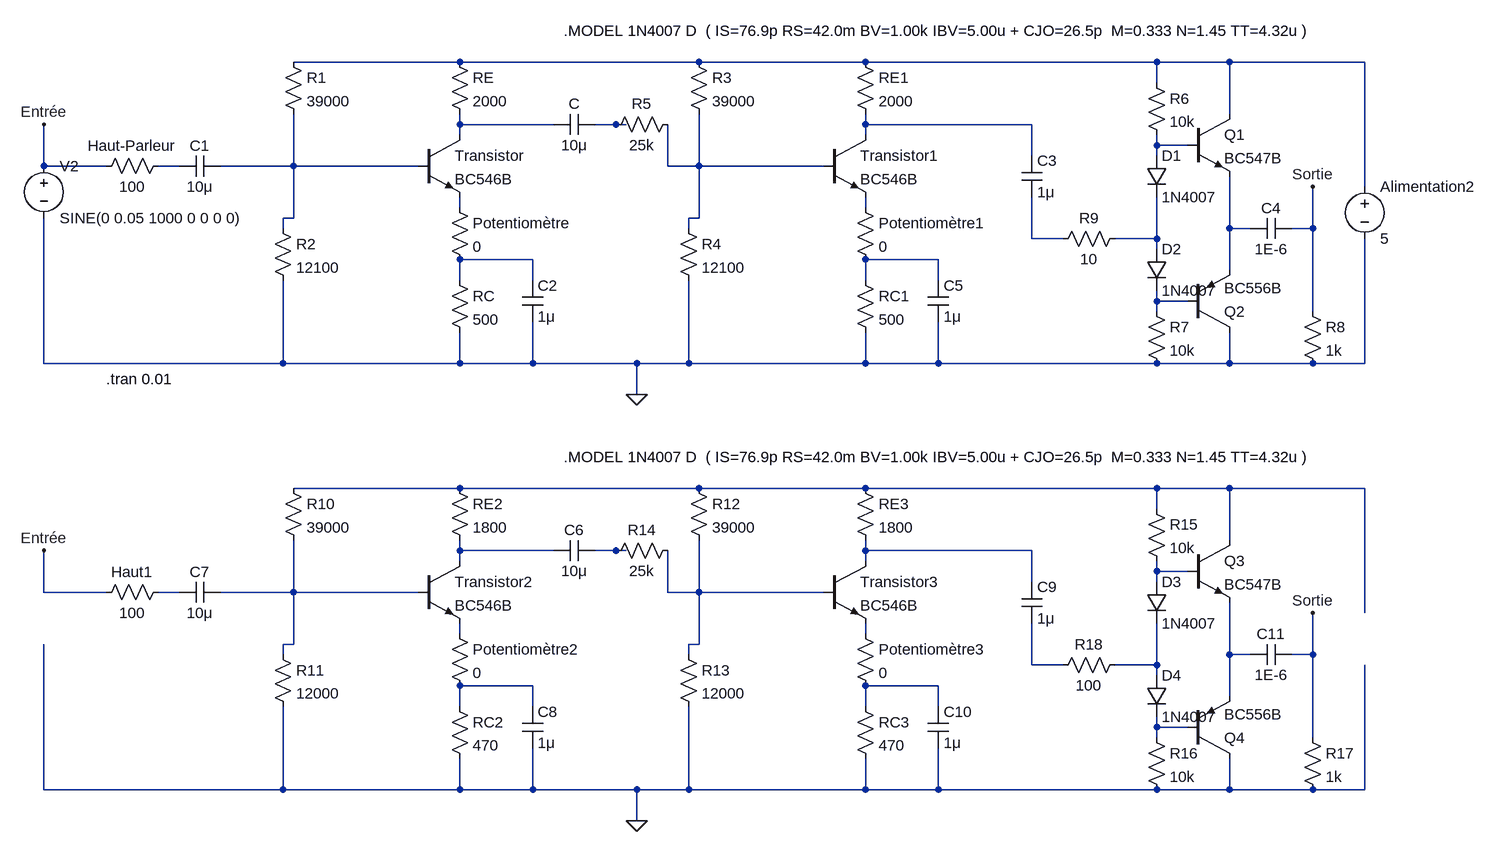
[diagram p0: schematic Cascade+PushPull - Copie.asc]
Cascade+PushPull - Copie.asc, the LTspice schematic file:
Version 4
SHEET 1 2696 1204
WIRE 368 16 112 16
WIRE 736 16 368 16
WIRE 992 16 736 16
WIRE 1440 16 992 16
WIRE 1552 16 1440 16
WIRE 1760 16 1552 16
WIRE 1440 48 1440 16
WIRE 1552 96 1552 16
WIRE 368 112 368 96
WIRE 512 112 368 112
WIRE 608 112 576 112
WIRE 624 112 608 112
WIRE 992 112 992 96
WIRE 1248 112 992 112
WIRE 368 128 368 112
WIRE 992 128 992 112
WIRE 1440 144 1440 128
WIRE 1488 144 1440 144
WIRE 1248 160 1248 112
WIRE 1440 160 1440 144
WIRE -272 176 -272 112
WIRE -176 176 -272 176
WIRE -64 176 -96 176
WIRE 112 176 112 96
WIRE 112 176 0 176
WIRE 304 176 112 176
WIRE 688 176 688 112
WIRE 736 176 736 96
WIRE 736 176 688 176
WIRE 928 176 736 176
WIRE 1760 208 1760 16
WIRE 368 240 368 224
WIRE 992 240 992 224
WIRE 112 256 112 176
WIRE 112 256 96 256
WIRE 736 256 736 176
WIRE 736 256 720 256
WIRE 96 272 96 256
WIRE 720 272 720 256
WIRE 1552 272 1552 192
WIRE 1584 272 1552 272
WIRE 1680 272 1680 208
WIRE 1680 272 1648 272
WIRE 1248 288 1248 224
WIRE 1296 288 1248 288
WIRE 1440 288 1440 224
WIRE 1440 288 1376 288
WIRE 1440 304 1440 288
WIRE 480 320 368 320
WIRE 1104 320 992 320
WIRE 1552 336 1552 272
WIRE 368 352 368 320
WIRE 480 352 480 320
WIRE 992 352 992 320
WIRE 1104 352 1104 320
WIRE 1440 384 1440 368
WIRE 1488 384 1440 384
WIRE 1440 400 1440 384
WIRE 1680 400 1680 272
WIRE -272 480 -272 256
WIRE 96 480 96 352
WIRE 96 480 -272 480
WIRE 368 480 368 432
WIRE 368 480 96 480
WIRE 480 480 480 416
WIRE 480 480 368 480
WIRE 640 480 480 480
WIRE 720 480 720 352
WIRE 720 480 640 480
WIRE 992 480 992 432
WIRE 992 480 720 480
WIRE 1104 480 1104 416
WIRE 1104 480 992 480
WIRE 1440 480 1104 480
WIRE 1552 480 1552 432
WIRE 1552 480 1440 480
WIRE 1680 480 1552 480
WIRE 1760 480 1760 288
WIRE 1760 480 1680 480
WIRE 640 528 640 480
WIRE 368 672 112 672
WIRE 736 672 368 672
WIRE 992 672 736 672
WIRE 1440 672 992 672
WIRE 1552 672 1440 672
WIRE 1760 672 1552 672
WIRE 1440 704 1440 672
WIRE 1552 752 1552 672
WIRE 368 768 368 752
WIRE 512 768 368 768
WIRE 608 768 576 768
WIRE 624 768 608 768
WIRE 992 768 992 752
WIRE 1248 768 992 768
WIRE 368 784 368 768
WIRE 992 784 992 768
WIRE 1440 800 1440 784
WIRE 1488 800 1440 800
WIRE 1248 816 1248 768
WIRE 1440 816 1440 800
WIRE -272 832 -272 768
WIRE -176 832 -272 832
WIRE -64 832 -96 832
WIRE 112 832 112 752
WIRE 112 832 0 832
WIRE 304 832 112 832
WIRE 688 832 688 768
WIRE 736 832 736 752
WIRE 736 832 688 832
WIRE 928 832 736 832
WIRE 1760 864 1760 672
WIRE 368 896 368 880
WIRE 992 896 992 880
WIRE 112 912 112 832
WIRE 112 912 96 912
WIRE 736 912 736 832
WIRE 736 912 720 912
WIRE 96 928 96 912
WIRE 720 928 720 912
WIRE 1552 928 1552 848
WIRE 1584 928 1552 928
WIRE 1680 928 1680 864
WIRE 1680 928 1648 928
WIRE 1248 944 1248 880
WIRE 1296 944 1248 944
WIRE 1440 944 1440 880
WIRE 1440 944 1376 944
WIRE 1440 960 1440 944
WIRE 480 976 368 976
WIRE 1104 976 992 976
WIRE 1552 992 1552 928
WIRE 368 1008 368 976
WIRE 480 1008 480 976
WIRE 992 1008 992 976
WIRE 1104 1008 1104 976
WIRE 1440 1040 1440 1024
WIRE 1488 1040 1440 1040
WIRE 1440 1056 1440 1040
WIRE 1680 1056 1680 928
WIRE -272 1136 -272 912
WIRE 96 1136 96 1008
WIRE 96 1136 -272 1136
WIRE 368 1136 368 1088
WIRE 368 1136 96 1136
WIRE 480 1136 480 1072
WIRE 480 1136 368 1136
WIRE 640 1136 480 1136
WIRE 720 1136 720 1008
WIRE 720 1136 640 1136
WIRE 992 1136 992 1088
WIRE 992 1136 720 1136
WIRE 1104 1136 1104 1072
WIRE 1104 1136 992 1136
WIRE 1440 1136 1104 1136
WIRE 1552 1136 1552 1088
WIRE 1552 1136 1440 1136
WIRE 1680 1136 1552 1136
WIRE 1760 1136 1760 944
WIRE 1760 1136 1680 1136
WIRE 640 1184 640 1136
FLAG 640 528 0
FLAG 1680 208 Sortie
FLAG 640 1184 0
FLAG -272 768 Entrée
FLAG 1680 864 Sortie
FLAG -272 112 Entrée
SYMBOL res 352 0 R0
SYMATTR InstName RE
SYMATTR Value 2000
SYMBOL res 352 336 R0
SYMATTR InstName RC
SYMATTR Value 500
SYMBOL res 96 0 R0
SYMATTR InstName R1
SYMATTR Value 39000
SYMBOL res 80 256 R0
SYMATTR InstName R2
SYMATTR Value 12100
SYMBOL npn 304 128 R0
SYMATTR InstName Transistor
SYMATTR Value BC546B
SYMBOL cap 576 96 R90
WINDOW 0 0 32 VBottom 2
WINDOW 3 32 32 VTop 2
SYMATTR InstName C
SYMATTR Value 10μ
SYMBOL cap 0 160 R90
WINDOW 0 0 32 VBottom 2
WINDOW 3 32 32 VTop 2
SYMATTR InstName C1
SYMATTR Value 10μ
SYMBOL cap 464 352 R0
SYMATTR InstName C2
SYMATTR Value 1μ
SYMBOL res -80 160 R90
WINDOW 0 0 56 VBottom 2
WINDOW 3 32 56 VTop 2
SYMATTR InstName Haut-Parleur
SYMATTR Value 100
SYMBOL res 352 224 R0
SYMATTR InstName Potentiomètre
SYMATTR Value 0
SYMBOL res 976 0 R0
SYMATTR InstName RE1
SYMATTR Value 2000
SYMBOL res 976 336 R0
SYMATTR InstName RC1
SYMATTR Value 500
SYMBOL res 720 0 R0
SYMATTR InstName R3
SYMATTR Value 39000
SYMBOL res 704 256 R0
SYMATTR InstName R4
SYMATTR Value 12100
SYMBOL npn 928 128 R0
SYMATTR InstName Transistor1
SYMATTR Value BC546B
SYMBOL cap 1232 160 R0
SYMATTR InstName C3
SYMATTR Value 1μ
SYMBOL cap 1088 352 R0
SYMATTR InstName C5
SYMATTR Value 1μ
SYMBOL res 976 224 R0
SYMATTR InstName Potentiomètre1
SYMATTR Value 0
SYMBOL res 704 96 R90
WINDOW 0 0 56 VBottom 2
WINDOW 3 32 56 VTop 2
SYMATTR InstName R5
SYMATTR Value 25k
SYMBOL res 1424 32 R0
SYMATTR InstName R6
SYMATTR Value 10k
SYMBOL res 1424 384 R0
SYMATTR InstName R7
SYMATTR Value 10k
SYMBOL diode 1424 160 R0
SYMATTR InstName D1
SYMATTR Value 1N4007
SYMBOL diode 1424 304 R0
SYMATTR InstName D2
SYMATTR Value 1N4007
SYMBOL npn 1488 96 R0
SYMATTR InstName Q1
SYMATTR Value BC547B
SYMBOL pnp 1488 432 M180
SYMATTR InstName Q2
SYMATTR Value BC556B
SYMBOL cap 1648 256 R90
WINDOW 0 0 32 VBottom 2
WINDOW 3 32 32 VTop 2
SYMATTR InstName C4
SYMATTR Value 1E-6
SYMBOL res 1664 384 R0
SYMATTR InstName R8
SYMATTR Value 1k
SYMBOL res 1392 272 R90
WINDOW 0 0 56 VBottom 2
WINDOW 3 32 56 VTop 2
SYMATTR InstName R9
SYMATTR Value 10
SYMBOL res 352 656 R0
SYMATTR InstName RE2
SYMATTR Value 1800
SYMBOL res 352 992 R0
SYMATTR InstName RC2
SYMATTR Value 470
SYMBOL res 96 656 R0
SYMATTR InstName R10
SYMATTR Value 39000
SYMBOL res 80 912 R0
SYMATTR InstName R11
SYMATTR Value 12000
SYMBOL npn 304 784 R0
SYMATTR InstName Transistor2
SYMATTR Value BC546B
SYMBOL cap 576 752 R90
WINDOW 0 0 32 VBottom 2
WINDOW 3 32 32 VTop 2
SYMATTR InstName C6
SYMATTR Value 10μ
SYMBOL cap 0 816 R90
WINDOW 0 0 32 VBottom 2
WINDOW 3 32 32 VTop 2
SYMATTR InstName C7
SYMATTR Value 10μ
SYMBOL cap 464 1008 R0
SYMATTR InstName C8
SYMATTR Value 1μ
SYMBOL res -80 816 R90
WINDOW 0 0 56 VBottom 2
WINDOW 3 32 56 VTop 2
SYMATTR InstName Haut1
SYMATTR Value 100
SYMBOL res 352 880 R0
SYMATTR InstName Potentiomètre2
SYMATTR Value 0
SYMBOL res 976 656 R0
SYMATTR InstName RE3
SYMATTR Value 1800
SYMBOL res 976 992 R0
SYMATTR InstName RC3
SYMATTR Value 470
SYMBOL res 720 656 R0
SYMATTR InstName R12
SYMATTR Value 39000
SYMBOL res 704 912 R0
SYMATTR InstName R13
SYMATTR Value 12000
SYMBOL npn 928 784 R0
SYMATTR InstName Transistor3
SYMATTR Value BC546B
SYMBOL cap 1232 816 R0
SYMATTR InstName C9
SYMATTR Value 1μ
SYMBOL cap 1088 1008 R0
SYMATTR InstName C10
SYMATTR Value 1μ
SYMBOL res 976 880 R0
SYMATTR InstName Potentiomètre3
SYMATTR Value 0
SYMBOL res 704 752 R90
WINDOW 0 0 56 VBottom 2
WINDOW 3 32 56 VTop 2
SYMATTR InstName R14
SYMATTR Value 25k
SYMBOL res 1424 688 R0
SYMATTR InstName R15
SYMATTR Value 10k
SYMBOL res 1424 1040 R0
SYMATTR InstName R16
SYMATTR Value 10k
SYMBOL diode 1424 816 R0
SYMATTR InstName D3
SYMATTR Value 1N4007
SYMBOL diode 1424 960 R0
SYMATTR InstName D4
SYMATTR Value 1N4007
SYMBOL npn 1488 752 R0
SYMATTR InstName Q3
SYMATTR Value BC547B
SYMBOL pnp 1488 1088 M180
SYMATTR InstName Q4
SYMATTR Value BC556B
SYMBOL cap 1648 912 R90
WINDOW 0 0 32 VBottom 2
WINDOW 3 32 32 VTop 2
SYMATTR InstName C11
SYMATTR Value 1E-6
SYMBOL res 1664 1040 R0
SYMATTR InstName R17
SYMATTR Value 1k
SYMBOL res 1392 928 R90
WINDOW 0 0 56 VBottom 2
WINDOW 3 32 56 VTop 2
SYMATTR InstName R18
SYMATTR Value 100
SYMBOL voltage 1760 192 R0
WINDOW 123 0 0 Left 0
WINDOW 39 0 0 Left 0
SYMATTR InstName Alimentation2
SYMATTR Value 5
SYMBOL voltage -272 160 R0
WINDOW 123 24 124 Left 2
WINDOW 39 0 0 Left 0
SYMATTR InstName V2
SYMATTR Value SINE(0 0.05 1000 0 0 0 0)
TEXT -176 504 Left 2 !.tran 0.01
TEXT 528 -32 Left 2 !.MODEL 1N4007 D  ( IS=76.9p RS=42.0m BV=1.00k IBV=5.00u + CJO=26.5p  M=0.333 N=1.45 TT=4.32u )
TEXT 528 624 Left 2 !.MODEL 1N4007 D  ( IS=76.9p RS=42.0m BV=1.00k IBV=5.00u + CJO=26.5p  M=0.333 N=1.45 TT=4.32u )

The netlist it stands for:
* Cascade+PushPull - Copie.asc
RE N001 N002 2000
RC N014 0 500
R1 N001 N007 39000
R2 N007 0 12100
Q§Transistor N002 N007 N009 0 BC546B
C N003 N002 10μ
C1 N007 N006 10μ
C2 N014 0 1μ
R§Haut-Parleur N006 Entrée 100
R§Potentiomètre N009 N014 0
RE1 N001 N004 2000
RC1 N015 0 500
R3 N001 N008 39000
R4 N008 0 12100
Q§Transistor1 N004 N008 N010 0 BC546B
C3 N004 N012 1μ
C5 N015 0 1μ
R§Potentiomètre1 N010 N015 0
R5 N008 N003 25k
R6 N001 N005 10k
R7 N016 0 10k
D1 N005 N013 1N4007
D2 N013 N016 1N4007
Q1 N001 N005 N011 0 BC547B
Q2 0 N016 N011 0 BC556B
C4 Sortie N011 1E-6
R8 Sortie 0 1k
R9 N013 N012 10
RE2 N017 N018 1800
RC2 N030 0 470
R10 N017 N023 39000
R11 N023 0 12000
Q§Transistor2 N018 N023 N025 0 BC546B
C6 N019 N018 10μ
C7 N023 N022 10μ
C8 N030 0 1μ
R§Haut1 N022 Entrée 100
R§Potentiomètre2 N025 N030 0
RE3 N017 N020 1800
RC3 N031 0 470
R12 N017 N024 39000
R13 N024 0 12000
Q§Transistor3 N020 N024 N026 0 BC546B
C9 N020 N028 1μ
C10 N031 0 1μ
R§Potentiomètre3 N026 N031 0
R14 N024 N019 25k
R15 N017 N021 10k
R16 N032 0 10k
D3 N021 N029 1N4007
D4 N029 N032 1N4007
Q3 N017 N021 N027 0 BC547B
Q4 0 N032 N027 0 BC556B
C11 Sortie N027 1E-6
R17 Sortie 0 1k
R18 N029 N028 100
V§Alimentation2 N001 0 5
V2 Entrée 0 SINE(0 0.05 1000 0 0 0 0)
.model D D
.lib standard.dio
.model NPN NPN
.model PNP PNP
.lib standard.bjt
.tran 0.01
.MODEL 1N4007 D  ( IS=76.9p RS=42.0m BV=1.00k IBV=5.00u + CJO=26.5p  M=0.333 N=1.45 TT=4.32u )
.MODEL 1N4007 D  ( IS=76.9p RS=42.0m BV=1.00k IBV=5.00u + CJO=26.5p  M=0.333 N=1.45 TT=4.32u )
.backanno
.end